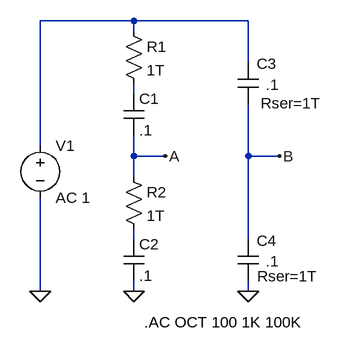
[diagram p0: schematic ACcap.asc]
ACcap.asc, the LTspice schematic file:
Version 4
SHEET 1 880 680
WIRE -112 304 -112 112
WIRE -112 528 -112 384
WIRE 32 112 -112 112
WIRE 32 128 32 112
WIRE 32 224 32 208
WIRE 32 320 32 288
WIRE 32 352 32 320
WIRE 32 448 32 432
WIRE 32 528 32 512
WIRE 80 320 32 320
WIRE 208 112 32 112
WIRE 208 176 208 112
WIRE 208 320 208 240
WIRE 208 448 208 320
WIRE 208 528 208 512
WIRE 256 320 208 320
FLAG -112 528 0
FLAG 32 528 0
FLAG 208 528 0
FLAG 80 320 A
FLAG 256 320 B
SYMBOL res 16 112 R0
SYMATTR InstName R1
SYMATTR Value 1T
SYMBOL cap 16 224 R0
SYMATTR InstName C1
SYMATTR Value .1
SYMBOL res 16 336 R0
SYMATTR InstName R2
SYMATTR Value 1T
SYMBOL cap 16 448 R0
SYMATTR InstName C2
SYMATTR Value .1
SYMBOL voltage -112 288 R0
SYMATTR InstName V1
SYMATTR Value AC 1
SYMBOL cap 192 176 R0
WINDOW 0 29 2 Left 0
WINDOW 3 43 34 Left 0
WINDOW 123 35 63 Left 0
SYMATTR InstName C3
SYMATTR Value .1
SYMATTR Value2 Rser=1T
SYMBOL cap 192 448 R0
WINDOW 0 29 2 Left 0
WINDOW 3 43 34 Left 0
WINDOW 39 30 57 Left 0
SYMATTR InstName C4
SYMATTR Value .1
SYMATTR SpiceLine Rser=1T
TEXT 48 576 Left 0 !.AC OCT 100 1K 100K

The netlist it stands for:
* ACcap.asc
R1 N001 N002 1T
C1 N002 A .1
R2 A N003 1T
C2 N003 0 .1
V1 N001 0 AC 1
C3 N001 B .1 Rser=1T
C4 B 0 .1 Rser=1T
.AC OCT 100 1K 100K
.backanno
.end